# Altium project Template.PrjPCB
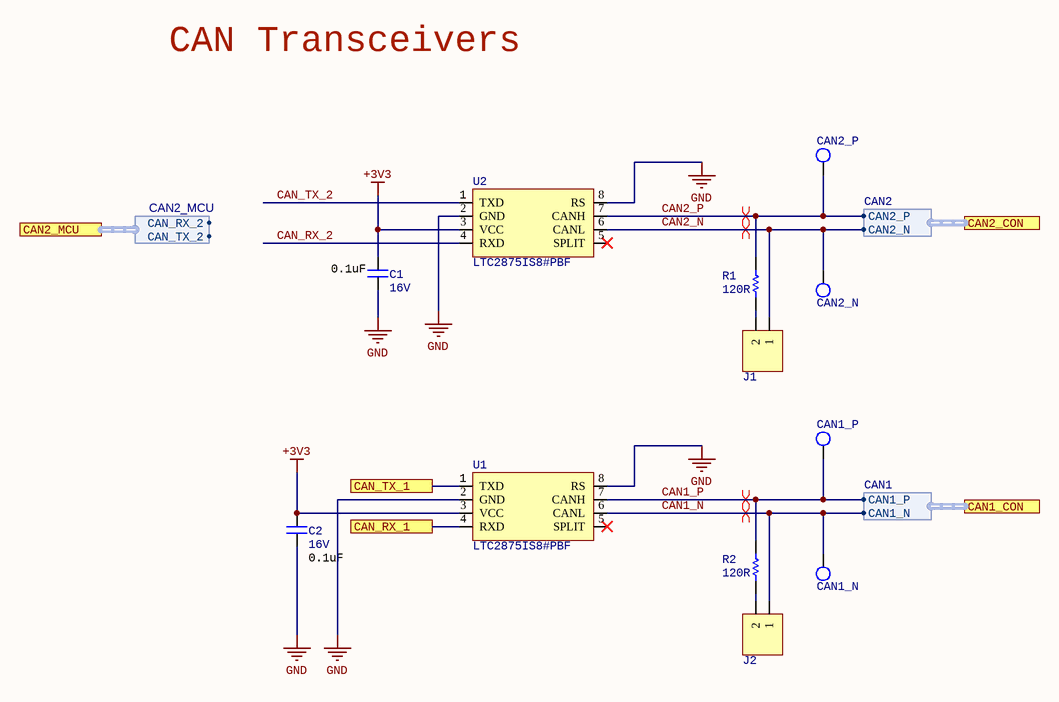
[diagram p0: CAN.SchDoc]
Address1: 200 University Avenue; Address2: Waterloo; Address3: Ontario; Address4: Canada N2L 3G6; BoardName: Your Board Name; DrawnBy: Your Name
5 sheets, 80 parts. Net scope: flat (ports and power ports of the same name join across sheets).
Board file: Template.PcbDoc
Sheets:
  CAN.SchDoc
  Connectors.SchDoc
  MCU.SchDoc
  POWER.SchDoc
  Support.SchDoc

## Sheet CAN.SchDoc: Gimbal CAN Schematic
size Letter; Author: Jing Hao Yao; DrawnBy: Jing Hao Yao & Aidan Gratton; Organization: UW Robotics; Address1: 200 University Avenue; Address2: Waterloo; Address3: Ontario; Address4: Canada N2L 3G6; SheetNumber: 2; SheetTotal: 5

### Parts
C1  value 0.1uF  Voltage Rating: 16V  [CAPC0603(1608)55_N]  (hidden comment: CAP_0.1uF_16V_0603)
C2  value 0.1uF  Voltage Rating: 16V  [CAPC0603(1608)55_N]  (hidden comment: CAP_0.1uF_16V_0603)
CAN1_N  TESTPOINT_LOOP  [TESTPOINT_LOOP]  (value not drawn)
CAN1_P  TESTPOINT_LOOP  [TESTPOINT_LOOP]  (value not drawn)
CAN2_N  TESTPOINT_LOOP  [TESTPOINT_LOOP]  (value not drawn)
CAN2_P  TESTPOINT_LOOP  [TESTPOINT_LOOP]  (value not drawn)
J1  JUMPER_2  [HDR1X2]  (value not drawn)
J2  JUMPER_2  [HDR1X2]  (value not drawn)
R1  value 120R  [RESC0603(1608)_N]  (hidden comment: RES_120R_0603)
R2  value 120R  [RESC0603(1608)_N]  (hidden comment: RES_120R_0603)
U1  MPN: LTC2875IS8#PBF  [LT-S8_N]  (hidden comment: IC TXRX CAN)
U2  MPN: LTC2875IS8#PBF  [LT-S8_N]  (hidden comment: IC TXRX CAN)

### Ports
CAN1_CON (harness CAN1), CAN2_CON (harness CAN2), CAN2_MCU (harness CAN2_MCU), CAN_RX_1, CAN_TX_1

### Harnesses
CAN1: CAN1_P, CAN1_N
CAN2: CAN2_P, CAN2_N
CAN2_MCU: CAN_RX_2, CAN_TX_2

### Nets
+3V3: C1.2 C2.2 U1.3(VCC) U2.3(VCC)
GND: C1.1 C2.1 U1.2(GND) U1.8(RS) U2.2(GND) U2.8(RS)
CAN1_N: CAN1_N.1 J2.1 U1.6(CANL) ; port CAN1_CON.CAN1_N
CAN1_P: CAN1_P.1 R2.1 U1.7(CANH) ; port CAN1_CON.CAN1_P
CAN2_N: CAN2_N.1 J1.1 U2.6(CANL) ; port CAN2_CON.CAN2_N
CAN2_P: CAN2_P.1 R1.1 U2.7(CANH) ; port CAN2_CON.CAN2_P
CAN_RX_2: U2.4(RXD)
CAN_TX_2: U2.1(TXD)
NetJ1_2: J1.2 R1.2
NetJ2_2: J2.2 R2.2
NetU1_1: U1.1(TXD) ; port CAN_TX_1
NetU1_4: U1.4(RXD) ; port CAN_RX_1

Not connected (* = marked no-connect by the designer): U1 5(SPLIT)*; U2 5(SPLIT)*

### Layout directives
differential pair: CAN1_N, CAN1_P, CAN2_N, CAN2_P

### Notes on the sheet
- CAN Transceivers
- Title
- Size:
- Date:
- Letter
- Drawn By:
- Sheet
- of
- File:

### Library data of the parts
C1 C2 = CAP_0.1uF_16V_0603: CAP CER 0.1UF 16V X7R 0603; MPN: CC0603KRX7R7BB104; Manufacturer: Yageo; Dimensions: 0.063" L x 0.031" W (1.60mm x 0.80mm); Package: 0603 (1608 Metric); Temperature Coefficient: X7R; Supplier Part Number 1: 311-1088-1-ND; Supplier 1: Digi-Key
CAN1_N CAN1_P CAN2_N CAN2_P = TESTPOINT_LOOP: Loop testpoint through-hole pad; Manufacturer: Keystone Electronics; Manufacturer Part Number 1: 5002; Supplier Part Number 1: 36-5002-ND; Supplier 1: Digi-Key
J1 J2 = JUMPER_2: HEADER 2X1
R1 R2 = RES_120R_0603: RES SMD 120 OHM 5% 1/10W 0603; Manufacturer: Yageo; MPN: RC0603JR-07120RL; Package: 0603 (1608 Metric); Dimensions: 0.063" L x 0.031" W (1.60mm x 0.80mm); Tolerance: 5%; Supplier Part Number 1: 311-120GRCT-ND; Supplier 1: Digi-Key
U1 U2 = LTC2875: IC TXRX CAN 4MBPS 8SO; Manufacturer: Linear Technologies; Package: 8-SOIC (0.154", 3.90mm Width); ComponentLink1Description: Datasheet; ComponentLink1URL: https://www.analog.com/media/en/technical-documentation/data-sheets/2875f.pdf; Supplier Part Number 1: LTC2875IS8#PBF-ND; Supplier 1: Digi-Key

## Sheet Connectors.SchDoc: Gimbal - Connectors
size Letter; DrawnBy: Jing Hao Yao & Aidan Gratton; Organization: UW Robotics; Address1: 200 University Avenue; Address2: Waterloo; Address3: Ontario; Address4: Canada N2L 3G6; SheetNumber: 3; SheetTotal: 5
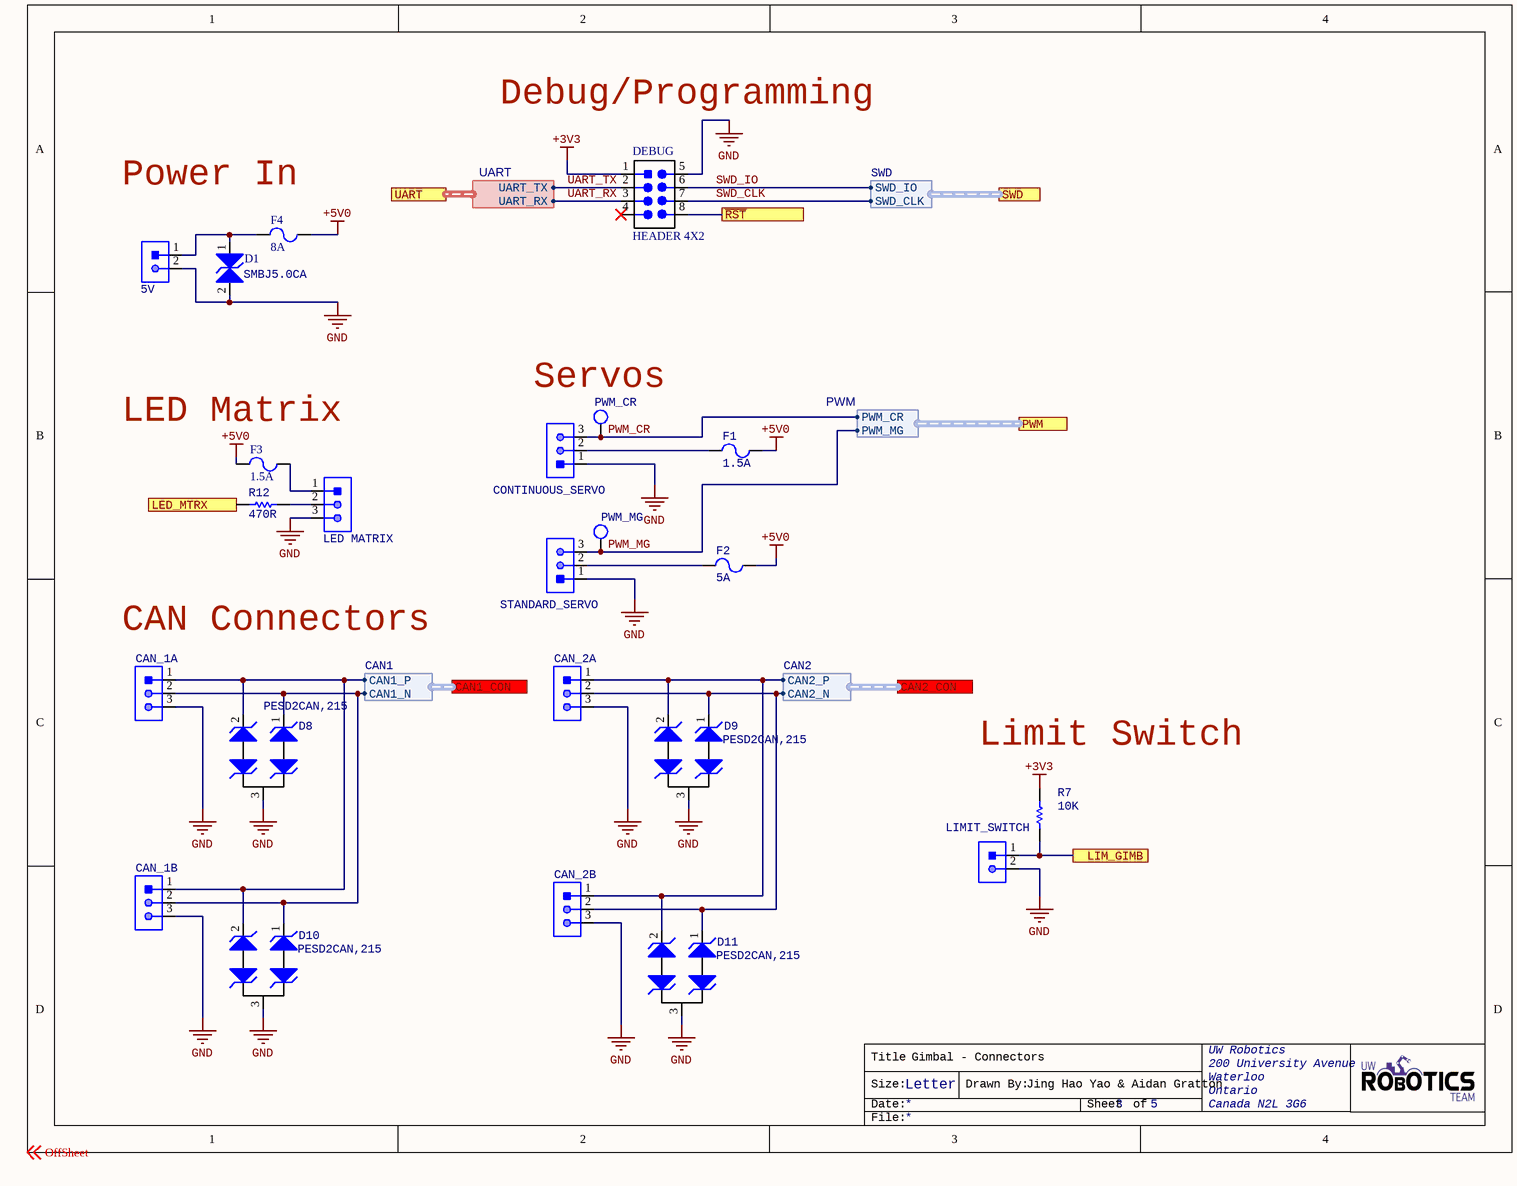
[diagram p1: Connectors.SchDoc]

### Parts
5V  CON_2M_SM4  [JST-B2B-SM4-TB]  (value not drawn)
CAN_1A  CON_3M_SM4  [JST-B3B-SM4-TB]  (value not drawn)
CAN_1B  CON_3M_SM4  [JST-B3B-SM4-TB]  (value not drawn)
CAN_2A  CON_3M_SM4  [JST-B3B-SM4-TB]  (value not drawn)
CAN_2B  CON_3M_SM4  [JST-B3B-SM4-TB]  (value not drawn)
CONTINUOUS_SERVO  CON_3M_SM4  [JST-B3B-SM4-TB]  (value not drawn)
D1  Manufacturer Part Number 1: SMBJ5.0CA  [TVS_DIODE_BIDIRECTIONAL]  (hidden comment: TVS_DIODE_BIDIRECTIONAL)
D8  Manufacturer Part Number: PESD2CAN,215  [TVS_DIODE_CAN]  (hidden comment: TVS_DIODE_CAN)
D9  Manufacturer Part Number: PESD2CAN,215  [TVS_DIODE_CAN]  (hidden comment: TVS_DIODE_CAN)
D10  Manufacturer Part Number: PESD2CAN,215  [TVS_DIODE_CAN]  (hidden comment: TVS_DIODE_CAN)
D11  Manufacturer Part Number: PESD2CAN,215  [TVS_DIODE_CAN]  (hidden comment: TVS_DIODE_CAN)
DEBUG  HEADER 4X2  [HEADER_2X4]
F1  Current Rating: 1.5A  [FUSE_0603]  (hidden comment: FUSE_1.5A_0603)
F2  Current Rating: 5A  [FUSE_0603]  (hidden comment: FUSE_5A_0603)
F3  Current Rating: 1.5A  [FUSE_0603]  (hidden comment: FUSE_1.5A_0603)
F4  Current Rating: 8A  [FUSE_0603]  (hidden comment: FUSE_8A_0603)
LED_MATRIX  CON_3M_SM4  [JST-B3B-SM4-TB]  (value not drawn)
LIMIT_SWITCH  CON_2M_SM4  [JST-B2B-SM4-TB]  (value not drawn)
PWM_CR  TESTPOINT_LOOP  [TESTPOINT_LOOP]  (value not drawn)
PWM_MG  TESTPOINT_LOOP  [TESTPOINT_LOOP]  (value not drawn)
R7  value 10K  [RESC0603(1608)_N]  (hidden comment: RES_10K_0603)
R12  value 470R  [RESC0603(1608)_N]  (hidden comment: 470R 1%)
STANDARD_SERVO  CON_3M_SM4  [JST-B3B-SM4-TB]  (value not drawn)

### Ports
CAN1_CON (harness CAN1), CAN2_CON (harness CAN2), LED_MTRX, LIM_GIMB, PWM (harness PWM), SWD (harness SWD), UART (harness UART), ~{RST}

### Harnesses
UART: UART_RX, UART_TX
CAN2: CAN2_P, CAN2_N
CAN1: CAN1_P, CAN1_N
PWM: PWM_CR, PWM_MG
SWD: SWD_CLK, SWD_IO

### Nets
+3V3: DEBUG.1(VCC) R7.2
+5V0: F1.2 F2.2 F3.1 F4.2
GND: 5V.2 CAN_1A.3 CAN_1B.3 CAN_2A.3 CAN_2B.3 CONTINUOUS_SERVO.1 D1.2 D8.3 D9.3 D10.3 D11.3 DEBUG.5(GND) LED_MATRIX.3 LIMIT_SWITCH.2 STANDARD_SERVO.1
CAN1_N: CAN_1A.2 CAN_1B.2 D8.1 D10.1 ; port CAN1_CON.CAN1_N
CAN1_P: CAN_1A.1 CAN_1B.1 D8.2 D10.2 ; port CAN1_CON.CAN1_P
CAN2_N: CAN_2A.2 CAN_2B.2 D9.1 D11.1 ; port CAN2_CON.CAN2_N
CAN2_P: CAN_2A.1 CAN_2B.1 D9.2 D11.2 ; port CAN2_CON.CAN2_P
PWM_CR: CONTINUOUS_SERVO.3 PWM_CR.1 ; port PWM.PWM_CR
PWM_MG: PWM_MG.1 STANDARD_SERVO.3 ; port PWM.PWM_MG
SWD_CLK: DEBUG.7 ; port SWD.SWD_CLK
SWD_IO: DEBUG.6 ; port SWD.SWD_IO
UART_RX: DEBUG.3 ; port UART.UART_RX
UART_TX: DEBUG.2 ; port UART.UART_TX
Net5V_1: 5V.1 D1.1 F4.1
NetC5_2: DEBUG.8 ; port ~{RST}
NetCONTINUOUS_SERVO_2: CONTINUOUS_SERVO.2 F1.1
NetF2_1: F2.1 STANDARD_SERVO.2
NetF3_2: F3.2 LED_MATRIX.1
NetLED_MATRIX_2: LED_MATRIX.2 R12.2
NetLIMIT_SWITCH_1: LIMIT_SWITCH.1 R7.1 ; port LIM_GIMB
NetR12_1: R12.1 ; port LED_MTRX

Not connected (* = marked no-connect by the designer): DEBUG 4*

### Notes on the sheet
- Debug/Programming
- Power In
- (near F3) LED Matrix
- Servos
- (near CAN_1A) CAN Connectors
- (near R7) Limit Switch
- Labels drawn without touching a wire or pin: OffSheet
- Title
- Size:
- Date:
- Letter
- Drawn By:
- Sheet
- of
- File:

### Library data of the parts
5V LIMIT_SWITCH = CON_2M_SM4: Manufacturer: JST; Manufacturer Part Number: B2B-PH-SM4-TB(LF)(SN); Max Current Rating: 2A; Max Voltage Rating: 100V; Pitch: 2mm; Supplier 1: Digi-Key; Supplier Part Number 1: 455-1734-1-ND; ComponentLink1URL: https://datasheet.ciiva.com/11748/0900766b80ddea81-11748001.pdf?src-supplier=RSComponents; ComponentLink1Description: https://datasheet.ciiva.com/11748/0900766b80ddea81-11748001.pdf?src-supplier=RSComponents; ComponentLink2URL: https://datasheet.ciiva.com/16216/b2b-ph-sm4-tblfsn-16216102.pdf?src-supplier=Future+Electronics; ComponentLink2Description: https://datasheet.ciiva.com/16216/b2b-ph-sm4-tblfsn-16216102.pdf?src-supplier=Future+Electronics; ComponentLink3URL: https://datasheet.ciiva.com/8052/80567-8052023.pdf?src-supplier=Element14; ComponentLink3Description: https://datasheet.ciiva.com/8052/80567-8052023.pdf?src-supplier=Element14; ComponentLink4URL: https://datasheet.ciiva.com/712/eph-712504.pdf?src-supplier=Digi-Key; ComponentLink4Description: https://datasheet.ciiva.com/712/eph-712504.pdf?src-supplier=Digi-Key; ComponentLink5URL: https://datasheet.ciiva.com/712/eph-712505.pdf?src-supplier=Digi-Key; ComponentLink5Description: https://datasheet.ciiva.com/712/eph-712505.pdf?src-supplier=Digi-Key; ComponentLink6URL: https://datasheet.ciiva.com/712/eph-712506.pdf?src-supplier=Digi-Key; ComponentLink6Description: https://datasheet.ciiva.com/712/eph-712506.pdf?src-supplier=Digi-Key
CAN_1A CAN_1B CAN_2A CAN_2B CONTINUOUS_SERVO LED_MATRIX STANDARD_SERVO = CON_3M_SM4: Manufacturer: JST; Manufacturer Part Number: B3B-PH-SM4-TB(LF)(SN); Max Current Rating: 2A; Max Voltage Rating: 100V; Pitch: 2mm; Supplier 1: Digi-Key; Supplier Part Number 1: 455-1735-1-ND; ComponentLink1URL: https://datasheet.ciiva.com/11747/0900766b80ddea81-11747684.pdf?src-supplier=RSComponents; ComponentLink1Description: https://datasheet.ciiva.com/11747/0900766b80ddea81-11747684.pdf?src-supplier=RSComponents
D1 = TVS_DIODE_BIDIRECTIONAL: TVS DIODE 5V 9.2V DO214AA; Manufacturer: Nexperia USA Inc.; Manufacturer 1: Littelfuse; Max Surge Current: 65.3A; Reverse Breakdown Voltage: 6.4V; Number of Elements: 1; Peak Pulse Power: 600W; Power Line Protection: No; Max Breakdown Voltage: 7V; Test Current: 10mA; ESD Protection: Yes; Max Reverse Leakage Current: 1.6mA; Max Power Dissipation: 5W; Element Configuration: Single; Package: SC-70, SOT-323; ComponentLink1Description: Datasheet; ComponentLink1URL: https://www.littelfuse.com/~/media/electronics/datasheets/tvs_diodes/littelfuse_tvs_diode_smbj_datasheet.pdf.pdf; Supplier Part Number 1: SMBJ5.0CALFCT-ND; Supplier 1: Digi-Key; Stock 1: 23233; Pricing 1: 1=0.39000, 10=0.31300, 25=0.28640, 100=0.17980, 250=0.17784, 500=0.16650, 1000=0.11322 (USD); Mount: Surface Mount; Case/Package: SMB; Number of Pins: 2; Min Operating Temperature: -65°C; Max Operating Temperature: 150°C; Direction: Bidirectional; Package Quantity: 3000; Packaging: Tape and Reel; Operating Supply Voltage: 5V; Number of Bidirectional Channels: 1; Reverse Standoff Voltage: 5V; Min Breakdown Voltage: 6.4V; Clamping Voltage: 9.2V; Breakdown Voltage: 6.4V; Number of Channels: 1; Polarity: Bidirectional; Power Dissipation: 600W; Peak Pulse Current: 65.3A; Leakage Current: 1.6mA; Voltage Rating (DC): 5V; Composition: Zener; Length: 0.179inch; Height: 0.096inch; Width: 0.155inch; Radiation Hardening: No; REACH SVHC: No SVHC; Lead Free: Lead Free
D8-D11 = TVS_DIODE_CAN: TVS DIODE 24V 41V SOT323-3; Manufacturer: Nexperia USA Inc.; Package: SC-70, SOT-323; ComponentLink1Description: Datasheet; ComponentLink1URL: https://assets.nexperia.com/documents/data-sheet/PESD1CAN-U.pdf; Supplier Part Number 1: 1727-3891-1-ND; Supplier 1: Digi-Key
DEBUG = HEADER 4X2: CONN HEADER VERT 8POS 2.54MM; Manufacturer Part Number 1: M20-9980445; Manufacturer 1: Harwin Inc.; Supplier Part Number 1: 952-2122-ND; Supplier 1: Digi-Key
F1 F3 = FUSE_1.5A_0603: FUSE SMD 1.5A 32V; ComponentLink1URL: https://datasheet.ciiva.com/26890/getdatasheetpartid-721713-26890390.pdf?src-supplier=Verical; ComponentLink1Description: https://datasheet.ciiva.com/26890/getdatasheetpartid-721713-26890390.pdf?src-supplier=Verical; ComponentLink2URL: https://datasheet.ciiva.com/7464/467-7464069.pdf?src-supplier=Digi-Key; ComponentLink2Description: https://datasheet.ciiva.com/7464/467-7464069.pdf?src-supplier=Digi-Key; ComponentLink3URL: https://datasheet.ciiva.com/7464/467-7464072.pdf?src-supplier=Digi-Key; ComponentLink3Description: https://datasheet.ciiva.com/7464/467-7464072.pdf?src-supplier=Digi-Key; Mount: Surface Mount; Voltage Rating (AC): 32V; Voltage Rating (DC): 32V; Supplier 1: Digi-Key; Supplier Part Number 1: F5702CT-ND; Supplier Packaging 1: Cut Tape
F2 = FUSE_5A_0603: FUSE SMD 5A 32V; Manufacturer 1: Littelfuse; Manufacturer Part Number 1: 0467005.NR; DC Cold Resistance: 8.9mR; Power Dissipation: 363.5mW; Fuse Type: Board Mount (Cartridge Style Excluded); Resistance: 9mR; Approvals: UL,CSA; Supplier 1: Digi-Key; Stock 1: 10729; Pricing 1: 1=1.20000, 5=1.16600, 10=1.09100, 50=0.90280, 100=0.75240, 250=0.73360, 500=0.62074, 1000=0.54549 (USD); RoHS: Yes; Mount: Surface Mount; Case/Package: 0603; Number of Pins: 2; Case Code (Metric): 1608; Case Code (Imperial): 0603; Min Operating Temperature: -55°C; Max Operating Temperature: 90°C; Voltage Rating (AC): 32V; Voltage Rating (DC): 32V; Packaging: Tape and Reel; Package Quantity: 5000; Composition: Thin Film; Fuse Current: 5A; Working Voltage: 32V; Length: 1.6mm; Height: 0.012inch; Width: 0.813mm; Depth: 0.81mm; Radiation Hardening: No; REACH SVHC: Unknown; Lead Free: Lead Free; ComponentLink1URL: https://datasheet.ciiva.com/26923/getdatasheetpartid-763340-26923403.pdf?src-supplier=Verical; ComponentLink1Description: https://datasheet.ciiva.com/26923/getdatasheetpartid-763340-26923403.pdf?src-supplier=Verical; ComponentLink2URL: https://datasheet.ciiva.com/1682/48494-1682052.pdf?src-supplier=Farnell; ComponentLink2Description: https://datasheet.ciiva.com/1682/48494-1682052.pdf?src-supplier=Farnell; ComponentLink3URL: https://datasheet.ciiva.com/299/467-299366.pdf?src-supplier=Digi-Key; ComponentLink3Description: https://datasheet.ciiva.com/299/467-299366.pdf?src-supplier=Digi-Key; ComponentLink4URL: https://datasheet.ciiva.com/1549/48494-1549727.pdf?src-supplier=Element14; ComponentLink4Description: https://datasheet.ciiva.com/1549/48494-1549727.pdf?src-supplier=Element14; ComponentLink5URL: https://datasheet.ciiva.com/299/467-299367.pdf?src-supplier=Digi-Key; ComponentLink5Description: https://datasheet.ciiva.com/299/467-299367.pdf?src-supplier=Digi-Key; ComponentLink6URL: https://datasheet.ciiva.com/299/467-299368.pdf?src-supplier=Digi-Key; ComponentLink6Description: https://datasheet.ciiva.com/299/467-299368.pdf?src-supplier=Digi-Key; ComponentLink7URL: https://datasheet.ciiva.com/16291/467-16291097.pdf?src-supplier=Future+Electronics; ComponentLink7Description: https://datasheet.ciiva.com/16291/467-16291097.pdf?src-supplier=Future+Electronics; Supplier Part Number 1: F1402CT-ND
F4 = FUSE_8A_0603: FUSE SMD 8A 63V; Voltage Rating (AC): 32V; Supplier 1: Digi-Key; Mount: Surface mount; Voltage Rating (DC): 63V; Supplier Packaging 1: Cut Tape; Parameter 1: *; Supplier Part Number 1: 507-2160-1-ND
PWM_CR PWM_MG = TESTPOINT_LOOP: as CAN1_N on sheet CAN; Supplier Part Number 1: 36-5002-ND; Supplier 1: Digi-Key
R7 = RES_10K_0603: RES SMD 10K OHM 5% 1/10W 0603; Manufacturer: Yageo; MPN: RC0603JR-0710KL; Package: 0603 (1608 Metric); Dimensions: 0.063" L x 0.031" W (1.60mm x 0.80mm); Tolerance: 5%; Supplier Part Number 1: 311-10KGRCT-ND; Supplier 1: Digi-Key
R12 = RES_470R_0603: RES SMD 470 OHM 1% 1/10W 0603; Manufacturer: Yageo; MPN: AC0603FR-07470RL; Package: 0603 (1608 Metric); Dimensions: 0.063" L x 0.031" W (1.60mm x 0.80mm); Tolerance: 1%; Supplier Part Number 1: 311-470LDCT-ND; Supplier 1: Digi-Key

## Sheet MCU.SchDoc: Gimbal - Microcontroller
size Letter; DrawnBy: Jing Hao Yao; Organization: UW Robotics; Address1: 200 University Avenue; Address2: Waterloo; Address3: Ontario; Address4: Canada N2L 3G6; SheetNumber: 1; SheetTotal: 5
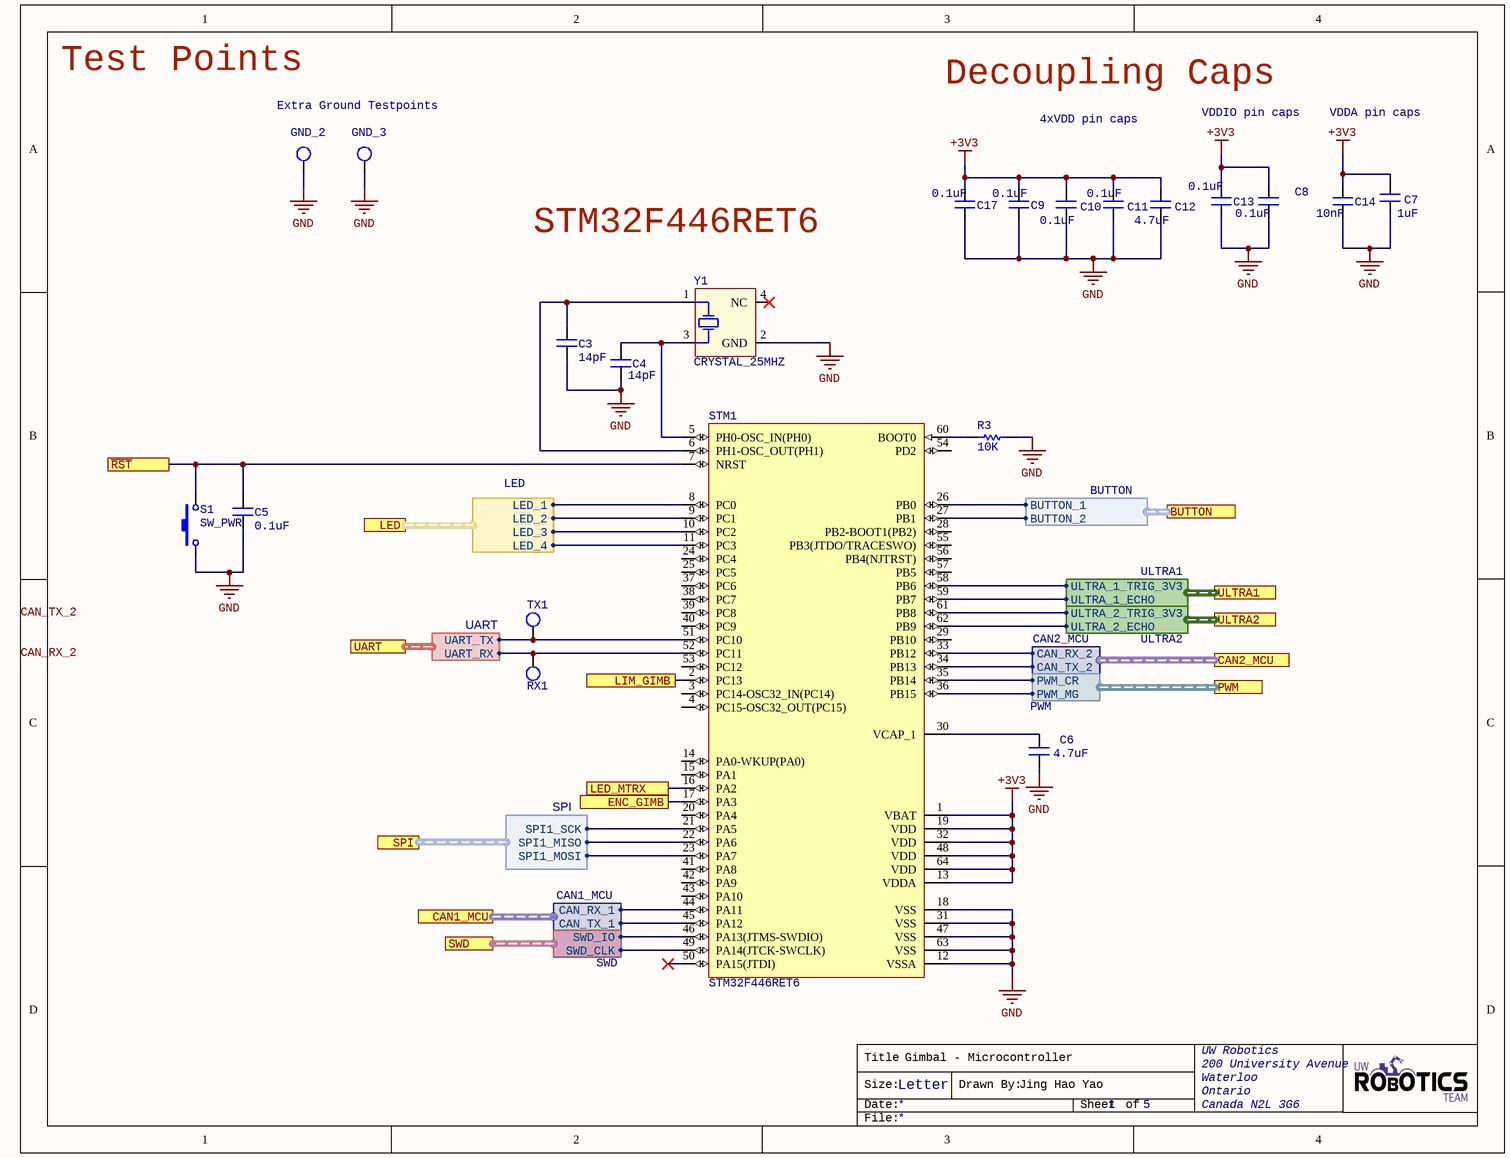
[diagram p2: MCU.SchDoc]

### Parts
C3  value 14pF  [CAPC0603(1608)55_N]  (hidden comment: CL10C140JB8NNNC)
C4  value 14pF  [CAPC0603(1608)55_N]  (hidden comment: CL10C140JB8NNNC)
C5  value 0.1uF  [CAPC0603(1608)55_N]  (hidden comment: CAP_0.1uF_16V_0603)
C6  value 4.7uF  [CAPC0603(1608)55_N]  (hidden comment: CAP_4.7uF_0603)
C7  value 1uF  [CAPC0603(1608)55_N]  (hidden comment: CAP_1uF_16V_0603)
C8  value 0.1uF  [CAPC0603(1608)55_N]  (hidden comment: CAP_0.1uF_16V_0603)
C9  value 0.1uF  [CAPC0603(1608)55_N]  (hidden comment: CAP_0.1uF_16V_0603)
C10  value 0.1uF  [CAPC0603(1608)55_N]  (hidden comment: CAP_0.1uF_16V_0603)
C11  value 0.1uF  [CAPC0603(1608)55_N]  (hidden comment: CAP_0.1uF_16V_0603)
C12  value 4.7uF  [CAPC0603(1608)55_N]  (hidden comment: CAP_4.7uF_0603)
C13  value 0.1uF  [CAPC0603(1608)55_N]  (hidden comment: CAP_0.1uF_16V_0603)
C14  value 10nF  [CAPC0603(1608)55_N]  (hidden comment: CAP_10nF_0603)
C17  value 0.1uF  [CAPC0603(1608)55_N]  (hidden comment: CAP_0.1uF_16V_0603)
GND_2  TESTPOINT_LOOP  [TESTPOINT_LOOP]  (value not drawn)
GND_3  TESTPOINT_LOOP  [TESTPOINT_LOOP]  (value not drawn)
R3  value 10K  [RESC0603(1608)_N]  (hidden comment: RES_10K_0603)
RX1  TESTPOINT_LOOP  [TESTPOINT_LOOP]  (value not drawn)
S1  SW_PWR  [PTS830GM140]
STM1  STM32F446RET6  [STM-LQFP64_L]
TX1  TESTPOINT_LOOP  [TESTPOINT_LOOP]  (value not drawn)
Y1  CRYSTAL_25MHZ  [AVX-CX2520DB32000D0GEJZ1-4_V]

### Ports
BUTTON (harness BUTTON), CAN1_MCU (harness CAN1_MCU), CAN2_MCU (harness CAN2_MCU), ENC_GIMB, LED (harness LED), LED_MTRX, LIM_GIMB, PWM (harness PWM), SPI (harness SPI), SWD (harness SWD), UART (harness UART), ULTRA1 (harness ULTRA1), ULTRA2 (harness ULTRA2), ~{RST}

### Harnesses
UART: UART_RX, UART_TX
ULTRA1: ULTRA_1_TRIG_3V3, ULTRA_1_ECHO
ULTRA2: ULTRA_2_TRIG_3V3, ULTRA_2_ECHO
CAN1_MCU: CAN_RX_1, CAN_TX_1
CAN2_MCU: CAN_RX_2, CAN_TX_2
LED: LED_1, LED_2, LED_3, LED_4
SPI: SPI1_SCK, SPI1_MISO, SPI1_MOSI
SWD: SWD_IO, SWD_CLK
BUTTON: BUTTON_1, BUTTON_2
PWM: PWM_CR, PWM_MG

### Nets
+3V3: C7.2 C8.2 C9.2 C10.2 C11.2 C12.2 C13.2 C14.2 C17.2 STM1.1(VBAT) STM1.13(VDDA) STM1.19(VDD) STM1.32(VDD) STM1.48(VDD) STM1.64(VDD)
GND: C3.1 C4.1 C5.1 C6.1 C7.1 C8.1 C9.1 C10.1 C11.1 C12.1 C13.1 C14.1 C17.1 GND_2.1 GND_3.1 R3.2 S1.1 STM1.12(VSSA) STM1.18(VSS) STM1.31(VSS) STM1.47(VSS) STM1.63(VSS) Y1.2(GND)
PWM_CR: STM1.35(PB14) ; port PWM.PWM_CR
PWM_MG: STM1.36(PB15) ; port PWM.PWM_MG
SWD_CLK: STM1.49(PA14(JTCK-SWCLK)) ; port SWD.SWD_CLK
SWD_IO: STM1.46(PA13(JTMS-SWDIO)) ; port SWD.SWD_IO
UART_RX: RX1.1 STM1.52(PC11) ; port UART.UART_RX
UART_TX: STM1.51(PC10) TX1.1 ; port UART.UART_TX
NetC3_2: C3.2 STM1.6(PH1-OSC_OUT(PH1)) Y1.1(HOT)
NetC4_2: C4.2 STM1.5(PH0-OSC_IN(PH0)) Y1.3(HOT)
NetC5_2: C5.2 S1.2 STM1.7(NRST) ; port ~{RST}
NetC6_2: C6.2 STM1.30(VCAP_1)
NetLIMIT_SWITCH_1: STM1.2(PC13) ; port LIM_GIMB
NetR3_1: R3.1 STM1.60(BOOT0)
NetR5_1: STM1.8(PC0) ; port LED.LED_1
NetR6_1: STM1.9(PC1) ; port LED.LED_2
NetR8_1: STM1.10(PC2) ; port LED.LED_3
NetR9_1: STM1.11(PC3) ; port LED.LED_4
NetR10_2: STM1.26(PB0) ; port BUTTON.BUTTON_1
NetR11_1: STM1.27(PB1) ; port BUTTON.BUTTON_2
NetR12_1: STM1.16(PA2) ; port LED_MTRX
NetSTM1_17: STM1.17(PA3) ; port ENC_GIMB
NetSTM1_21: STM1.21(PA5) ; port SPI.SPI1_SCK
NetSTM1_22: STM1.22(PA6) ; port SPI.SPI1_MISO
NetSTM1_23: STM1.23(PA7) ; port SPI.SPI1_MOSI
NetSTM1_33: STM1.33(PB12) ; port CAN2_MCU.CAN_RX_2
NetSTM1_34: STM1.34(PB13) ; port CAN2_MCU.CAN_TX_2
NetSTM1_44: STM1.44(PA11) ; port CAN1_MCU.CAN_RX_1
NetSTM1_45: STM1.45(PA12) ; port CAN1_MCU.CAN_TX_1
NetSTM1_58: STM1.58(PB6) ; port ULTRA1.ULTRA_1_TRIG_3V3
NetSTM1_59: STM1.59(PB7) ; port ULTRA1.ULTRA_1_ECHO
NetSTM1_61: STM1.61(PB8) ; port ULTRA2.ULTRA_2_TRIG_3V3
NetSTM1_62: STM1.62(PB9) ; port ULTRA2.ULTRA_2_ECHO

Not connected (* = marked no-connect by the designer): STM1 3(PC14-OSC32_IN(PC14)) 4(PC15-OSC32_OUT(PC15)) 14(PA0-WKUP(PA0)) 15(PA1) 20(PA4) 24(PC4) 25(PC5) 28(PB2-BOOT1(PB2)) 29(PB10) 37(PC6) 38(PC7) 39(PC8) 40(PC9) 41(PA8) 42(PA9) 43(PA10) 50(PA15(JTDI))* 53(PC12) 54(PD2) 55(PB3(JTDO/TRACESWO)) 56(PB4(NJTRST)) 57(PB5); Y1 4(NC)*

### Notes on the sheet
- Test Points
- Decoupling Caps
- Extra Ground Testpoints
- 4xVDD pin caps
- VDDIO pin caps
- VDDA pin caps
- STM32F446RET6
- Labels drawn without touching a wire or pin: CAN_RX_2, CAN_TX_2
- Title
- Size:
- Date:
- Letter
- Drawn By:
- Sheet
- of
- File:

### Library data of the parts
C3 C4 = CL10C140JB8NNNC: Cap Ceramic 14pF 50V C0G 5% SMD 0603 125C Cardboard T/R; Manufacturer 1: Samsung; Voltage Rating: 50V; Supplier Part Number 1: 1276-2187-1-ND; Supplier 1: Digi-Key; Manufacturer Part Number 1: CL10C140JB8NNNC; Stock 1: 187088; Pricing 1: 1=0.10000, 10=0.06700, 100=0.02980, 500=0.02130, 1000=0.01673 (USD); RoHS: Yes; Mount: Surface Mount; Case/Package: 0603; Case Code (Metric): 1608; Case Code (Imperial): 0603; Min Operating Temperature: -55°C; Max Operating Temperature: 125°C; Tolerance: 5%; Package Quantity: 1; Packaging: Tape and Reel; Voltage Rating (DC): 50V; Dielectric: C0G; Length: 1.6mm; Height: 0.8mm; Width: 0.031inch; Depth: 0.8mm; Thickness: 0.035inch; Radiation Hardening: No; ComponentLink1URL: https://datasheet.ciiva.com/25782/cl10c140jb8nnnc-25782947.pdf?src-supplier=Digi-Key; ComponentLink1Description: https://datasheet.ciiva.com/25782/cl10c140jb8nnnc-25782947.pdf?src-supplier=Digi-Key; Capacitance: 14pF
C5 C8-C11 C13 C17 = CAP_0.1uF_16V_0603: CAP CER 0.1UF 16V X7R 0603; Manufacturer: Yageo; MPN: CC0603KRX7R7BB104; Dimensions: 0.063" L x 0.031" W (1.60mm x 0.80mm); Package: 0603 (1608 Metric); Temperature Coefficient: X7R; Voltage Rating: 16V; Supplier Part Number 1: 311-1088-1-ND; Supplier 1: Digi-Key
C6 C12 = CAP_4.7uF_0603: CAP CER 4.7UF 6.3V X5R 0603; Manufacturer: Yageo; MPN: CC0603KRX5R5BB475; Dimensions: 0.063" L x 0.031" W (1.60mm x 0.80mm); Package: 0603 (1608 Metric); Temperature Coefficient: X5R; Voltage Rating: 6.3V; Supplier Part Number 1: 311-1521-1-ND; Supplier 1: Digi-Key
C7 = CAP_1uF_16V_0603: CAP CER 1UF 16V Y5V 0603; Manufacturer: Yageo; MPN: CC0603ZRY5V7BB105; Dimensions: 0.063" L x 0.031" W (1.60mm x 0.80mm); Package: 0603 (1608 Metric); Temperature Coefficient: Y5V; Voltage Rating: 16V; Supplier Part Number 1: 311-1372-1-ND; Supplier 1: Digi-Key
C14 = CAP_10nF_0603: CAP CER 10000PF 16V X7R 0603; Manufacturer: Yageo; MPN: CC0603KRX7R7BB103; Dimensions: 0.063" L x 0.031" W (1.60mm x 0.80mm); Package: 0603 (1608 Metric); Temperature Coefficient: X7R; Voltage Rating: 16V; Supplier Part Number 1: 311-3369-1-ND; Supplier 1: Digi-Key
GND_2 GND_3 RX1 TX1 = TESTPOINT_LOOP: as CAN1_N on sheet CAN; Supplier Part Number 1: 36-5002-ND; Supplier 1: Digi-Key
R3 = RES_10K_0603: as R7 on sheet Connectors; Package: 0603 (1608 Metric); Dimensions: 0.063" L x 0.031" W (1.60mm x 0.80mm); Tolerance: 5%; Supplier Part Number 1: 311-10KGRCT-ND; Supplier 1: Digi-Key
S1 = SW_PWR: Power Switch (Red); pin to pad: 2>4; MPN: PTS830GM140 SMTR LFS; Manufacturer: C&K; ComponentLink1Description: Datasheet; ComponentLink1URL: https://www.ckswitches.com/media/1478/pts830.pdf; Supplier Part Number 1: CKN10587CT-ND; Supplier 1: Digi-Key
STM1 = MCU_STM32F446RET6: ARM Cortex-M4 32-bit MCU+FPU, 512 KB Flash, 128 KB Internal RAM, 50 I/Os, 64-Pin LQFP, -40 to 85 degC, Tray; I/Os (High Current): 50; Supply Voltage(Vcc) min (V): 1.7; Operating Frequency(F) (Processor speed) (MHz): 180; D/A Converter: 2; Internal RAM Size (kB): 128; FLASH Size (Prog) (kB): 512; Core: ARM Cortex-M4; ComponentLink1Description: Manufacturer URL; Package Reference: 64-Pin Low-profile Quad Flat Package, Body 10 x 10 mm, Pitch 0.5 mm; ComponentLink2URL: http://www.st.com/st-web-ui/static/active/en/resource/technical/document/datasheet/DM00141306.pdf; Packing: Tray; DatasheetVersion: Rev. 6; ComponentLink1URL: http://www.st.com/; ComponentLink2Description: Datasheet; Package Description: LQFP64; Mounting Technology: Surface Mount; Supplier Part Number 1: 497-15376-ND; Supplier 1: Digi-Key
Y1 = CRYSTAL_25MHZ: CRYSTAL 25.0000MHZ 12PF SMD; Manufacturer 1: Kyocera AVX; Manufacturer Part Number 1: CX2520DB25000H0FLJC1; Frequency: 25MHz; ESR (Equivalent Series Resistance): 80R; Frequency Stability: 15ppm; Frequency Tolerance: 10ppm; ComponentLink1Description: https://media.digikey.com/pdf/Data%20Sheets/AVX%20PDFs/CX2520DB_USY1M-H1-16429-00_Spec.pdf?src-supplier=Digi-Key; ComponentLink1URL: https://media.digikey.com/pdf/Data%20Sheets/AVX%20PDFs/CX2520DB_USY1M-H1-16429-00_Spec.pdf?src-supplier=Digi-Key; Supplier 1: Digi-Key; Supplier Part Number 1: 1253-1724-1-ND; Stock 1: 11741; Pricing 1: 1=0.72000, 10=0.63300, 50=0.59120, 100=0.52250, 500=0.49500, 1000=0.41250 (USD); RoHS: Yes; Mount: Surface Mount; Case/Package: SMD/SMT; Min Operating Temperature: -30°C; Max Operating Temperature: 85°C; Packaging: Tape and Reel; Load Capacitance: 12pF; Length: 0.098inch; Height: 0.022inch; Width: 0.079inch; Ratings: AEC-Q200

## Sheet POWER.SchDoc: Gimbal - Power
size Letter; Author: Aidan Gratton; DrawnBy: Aidan Gratton; Organization: UW Robotics; Address1: 200 University Avenue; Address2: Waterloo; Address3: Ontario; Address4: Canada N2L 3G6; SheetNumber: 2; SheetTotal: 5
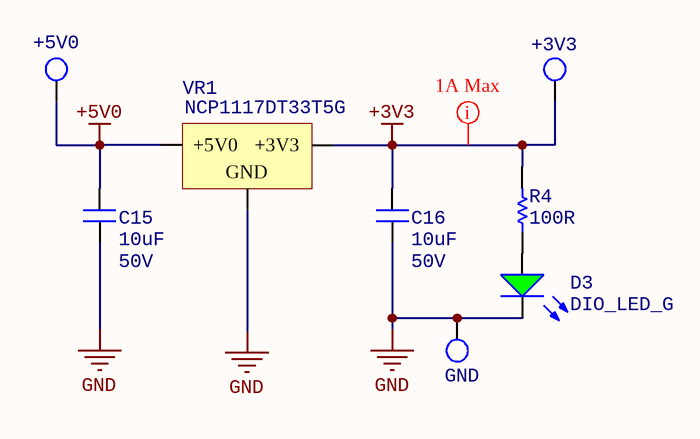
[diagram p3: POWER.SchDoc]

### Parts
+3V3  TESTPOINT_LOOP  [TESTPOINT_LOOP]  (value not drawn)
+5V0  TESTPOINT_LOOP  [TESTPOINT_LOOP]  (value not drawn)
C15  Voltage Rating: 50V  [CAPC1206(3216)]  (hidden comment: 10uF)
C16  Voltage Rating: 50V  [CAPC1206(3216)]  (hidden comment: 10uF)
D3  DIO_LED_G  [LED_0805_LINE]
GND  TESTPOINT_LOOP  [TESTPOINT_LOOP]  (value not drawn)
R4  value 100R  [RESC0603(1608)_N]  (hidden comment: RES_100R_0603)
VR1  MPN: NCP1117DT33T5G  [VOLTAGE_REGULATOR]  (hidden comment: 5V0_3V3_LDO)

### Nets
+3V3: +3V3.1 C16.2 R4.2 VR1.2(+3V3)
+5V0: +5V0.1 C15.2 VR1.3(+5V0)
GND: C15.1 C16.1 D3.2(K) GND.1 VR1.1(GND)
NetD3_1: D3.1(A) R4.1

### Layout directives
mark named 1A Max: +3V3

### Notes on the sheet
- Title
- Size:
- Date:
- Letter
- Drawn By:
- Sheet
- of
- File:

### Library data of the parts
+3V3 +5V0 GND = TESTPOINT_LOOP: as CAN1_N on sheet CAN; Supplier Part Number 1: 36-5002-ND; Supplier 1: Digi-Key
C15 C16 = CAP_10uF_50V_1206: CAP CER 10UF 50V X5R 1206; MPN: GRT31CR61H106KE01L; Manufacturer: Murata; Dimensions: 0.126" L x 0.063" W (3.20mm x 1.6mm); Package: 1206 (3216 Metric); Supplier Part Number 1: 490-12456-1-ND; Supplier 1: Digi-Key; Value: 10uF
D3 = DIO_LED_G: LED GREEN DIFFUSED 0805 SMD; MPN: LG R971-KN-1; Manufacturer: OSRAM; Forward Voltage Drop: 2.2V; Package: 0805 (2012 Metric); Supplier Part Number 1: 475-1410-1-ND; Supplier 1: Digi-Key
R4 = RES_100R_0603: RES SMD 100 OHM 1% 1/10W 0603; Manufacturer: Yageo; MPN: RC0603FR-07100RL; Package: 0603 (1608 Metric); Dimensions: 0.063" L x 0.031" W (1.60mm x 0.80mm); Tolerance: 1%; Supplier Part Number 1: 311-100HRCT-ND; Supplier 1: Digi-Key
VR1 = 5V0_3V3_LDO: IC REG LINEAR 3.3V 1A DPAK; Manufacturer: ON Semiconductor; Current Output: 1A; Supplier Part Number 1: NCP1117DT33T5GOSCT-ND; Supplier 1: Digi-Key

## Sheet Support.SchDoc: Gimbal Support Schematic
size Letter; DrawnBy: Aidan Gratton; Organization: UW Robotics; Address1: 200 University Avenue; Address2: Waterloo; Address3: Ontario; Address4: Canada N2L 3G6; SheetNumber: 5; SheetTotal: 5
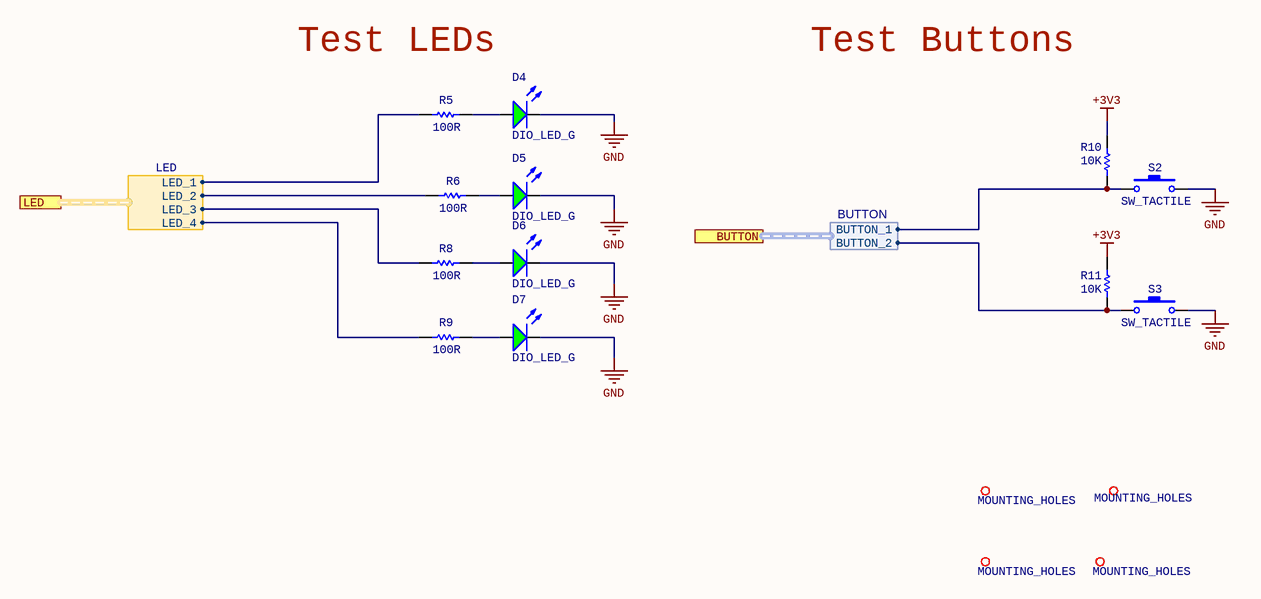
[diagram p4: Support.SchDoc]

### Parts
D4  DIO_LED_G  [LED_0805_LINE]
D5  DIO_LED_G  [LED_0805_LINE]
D6  DIO_LED_G  [LED_0805_LINE]
D7  DIO_LED_G  [LED_0805_LINE]
MH1  MOUNTING_HOLES  [MOUNTING_HOLE]
MH2  MOUNTING_HOLES  [MOUNTING_HOLE]
MH3  MOUNTING_HOLES  [MOUNTING_HOLE]
MH4  MOUNTING_HOLES  [MOUNTING_HOLE]
R5  value 100R  [RESC0603(1608)_N]  (hidden comment: RES_100R_0603)
R6  value 100R  [RESC0603(1608)_N]  (hidden comment: RES_100R_0603)
R8  value 100R  [RESC0603(1608)_N]  (hidden comment: RES_100R_0603)
R9  value 100R  [RESC0603(1608)_N]  (hidden comment: RES_100R_0603)
R10  value 10K  [RESC0603(1608)_N]  (hidden comment: RES_10K_0603)
R11  value 10K  [RESC0603(1608)_N]  (hidden comment: RES_10K_0603)
S2  SW_TACTILE  [B3U-1100P]
S3  SW_TACTILE  [B3U-1100P]

### Ports
BUTTON (harness BUTTON), LED (harness LED)

### Harnesses
LED: LED_1, LED_2, LED_3, LED_4
BUTTON: BUTTON_1, BUTTON_2

### Nets
+3V3: R10.1 R11.2
GND: D4.2(K) D5.2(K) D6.2(K) D7.2(K) S2.2 S3.2
NetD4_1: D4.1(A) R5.2
NetD5_1: D5.1(A) R6.2
NetD6_1: D6.1(A) R8.2
NetD7_1: D7.1(A) R9.2
NetR5_1: R5.1 ; port LED.LED_1
NetR6_1: R6.1 ; port LED.LED_2
NetR8_1: R8.1 ; port LED.LED_3
NetR9_1: R9.1 ; port LED.LED_4
NetR10_2: R10.2 S2.1 ; port BUTTON.BUTTON_1
NetR11_1: R11.1 S3.1 ; port BUTTON.BUTTON_2

### Notes on the sheet
- Test LEDs
- Test Buttons
- Title
- Size:
- Date:
- Letter
- Drawn By:
- Sheet
- of
- File:

### Library data of the parts
D4-D7 = DIO_LED_G: LED GREEN DIFFUSED 0805 SMD; Manufacturer: OSRAM; MPN: LG R971-KN-1; Forward Voltage Drop: 2.2V; Package: 0805 (2012 Metric); Supplier Part Number 1: 475-1410-1-ND; Supplier 1: Digi-Key
MH1-MH4 = MOUNTING_HOLES: 6cm x 6cm
R5 R6 R8 R9 = RES_100R_0603: as R4 on sheet POWER; Package: 0603 (1608 Metric); Dimensions: 0.063" L x 0.031" W (1.60mm x 0.80mm); Tolerance: 1%; Supplier Part Number 1: 311-100HRCT-ND; Supplier 1: Digi-Key
R10 R11 = RES_10K_0603: as R7 on sheet Connectors; Package: 0603 (1608 Metric); Dimensions: 0.063" L x 0.031" W (1.60mm x 0.80mm); Tolerance: 5%; Supplier Part Number 1: 311-10KGRCT-ND; Supplier 1: Digi-Key
S2 S3 = SW_TACTILE: Tactile Switch (Grey); Manufacturer: Omron Electronics Inc-EMC Div; MPN: B3U-1100P; Supplier Part Number 1: SW1021CT-ND; Supplier 1: Digi-Key

## Nets that join several sheets
+3V3: CAN (C1.2 C2.2 U1.3 U2.3), Connectors (DEBUG.1 R7.2), MCU (15 pins), POWER (+3V3.1 C16.2 R4.2 VR1.2), Support (R10.1 R11.2)
+5V0: Connectors (F1.2 F2.2 F3.1 F4.2), POWER (+5V0.1 C15.2 VR1.3)
GND: CAN (6 pins), Connectors (15 pins), MCU (23 pins), POWER (5 pins), Support (6 pins)
CAN1_N: CAN (CAN1_N.1 J2.1 U1.6), Connectors (CAN_1A.2 CAN_1B.2 D8.1 D10.1)
CAN1_P: CAN (CAN1_P.1 R2.1 U1.7), Connectors (CAN_1A.1 CAN_1B.1 D8.2 D10.2)
CAN2_N: CAN (CAN2_N.1 J1.1 U2.6), Connectors (CAN_2A.2 CAN_2B.2 D9.1 D11.1)
CAN2_P: CAN (CAN2_P.1 R1.1 U2.7), Connectors (CAN_2A.1 CAN_2B.1 D9.2 D11.2)
NetC5_2: Connectors (DEBUG.8), MCU (C5.2 S1.2 STM1.7)
NetLIMIT_SWITCH_1: Connectors (LIMIT_SWITCH.1 R7.1), MCU (STM1.2)
NetR5_1: MCU (STM1.8), Support (R5.1)
NetR6_1: MCU (STM1.9), Support (R6.1)
NetR8_1: MCU (STM1.10), Support (R8.1)
NetR9_1: MCU (STM1.11), Support (R9.1)
NetR10_2: MCU (STM1.26), Support (R10.2 S2.1)
NetR11_1: MCU (STM1.27), Support (R11.1 S3.1)
NetR12_1: Connectors (R12.1), MCU (STM1.16)
PWM_CR: Connectors (CONTINUOUS_SERVO.3 PWM_CR.1), MCU (STM1.35)
PWM_MG: Connectors (PWM_MG.1 STANDARD_SERVO.3), MCU (STM1.36)
SWD_CLK: Connectors (DEBUG.7), MCU (STM1.49)
SWD_IO: Connectors (DEBUG.6), MCU (STM1.46)
UART_RX: Connectors (DEBUG.3), MCU (RX1.1 STM1.52)
UART_TX: Connectors (DEBUG.2), MCU (STM1.51 TX1.1)